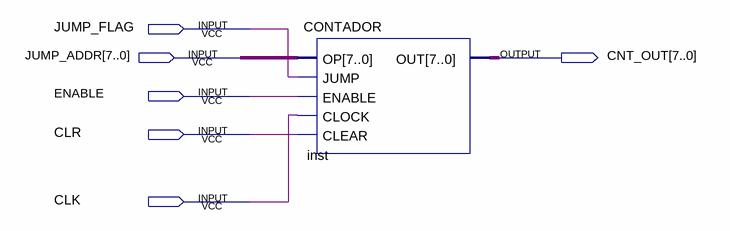
[diagram p0: schematic sheet]
// Quartus schematic TESTE_CONTADOR.bdf as structural Verilog: 1 symbols, 6 pins
module TESTE_CONTADOR (
  input  JUMP_FLAG,
  input  [7:0] JUMP_ADDR,
  input  ENABLE,
  input  CLR,
  input  CLK,
  output [7:0] CNT_OUT
);

  CONTADOR inst (.OP(JUMP_ADDR), .JUMP(JUMP_FLAG), .ENABLE(ENABLE), .CLOCK(CLK), .CLEAR(CLR), .OUT(CNT_OUT));
endmodule
